# EAGLE design PWM Driver - Bridge Only (EAGLE 5.07)
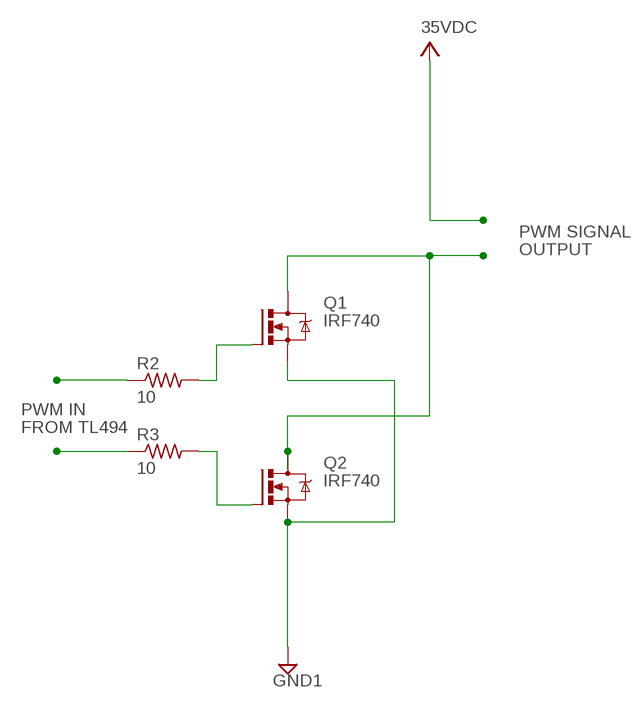
[diagram p0: schematic, sheet 1]

## Parts
Q1  IRF740  [TO220BV]
Q2  IRF740  [TO220BV]
R2  10  R-US_0207/10  [0207/10]
R3  10  R-US_0207/10  [0207/10]

## Nets
GND1: Q1.S Q2.S
N$1: R2.1
N$2: R3.1
N$3: Q1.D Q2.D
N$11: Q2.G R3.2
R2: Q1.G R2.2

## Notes on the sheet
- PWM SIGNAL
- OUTPUT
- PWM IN
- FROM TL494

## Library data of the parts
Q1 Q2 = transistor-power:IRF740: N-CHANNEL MOS FET
R2 R3 = resistor:R-US_: RESISTOR, American symbol

## Board
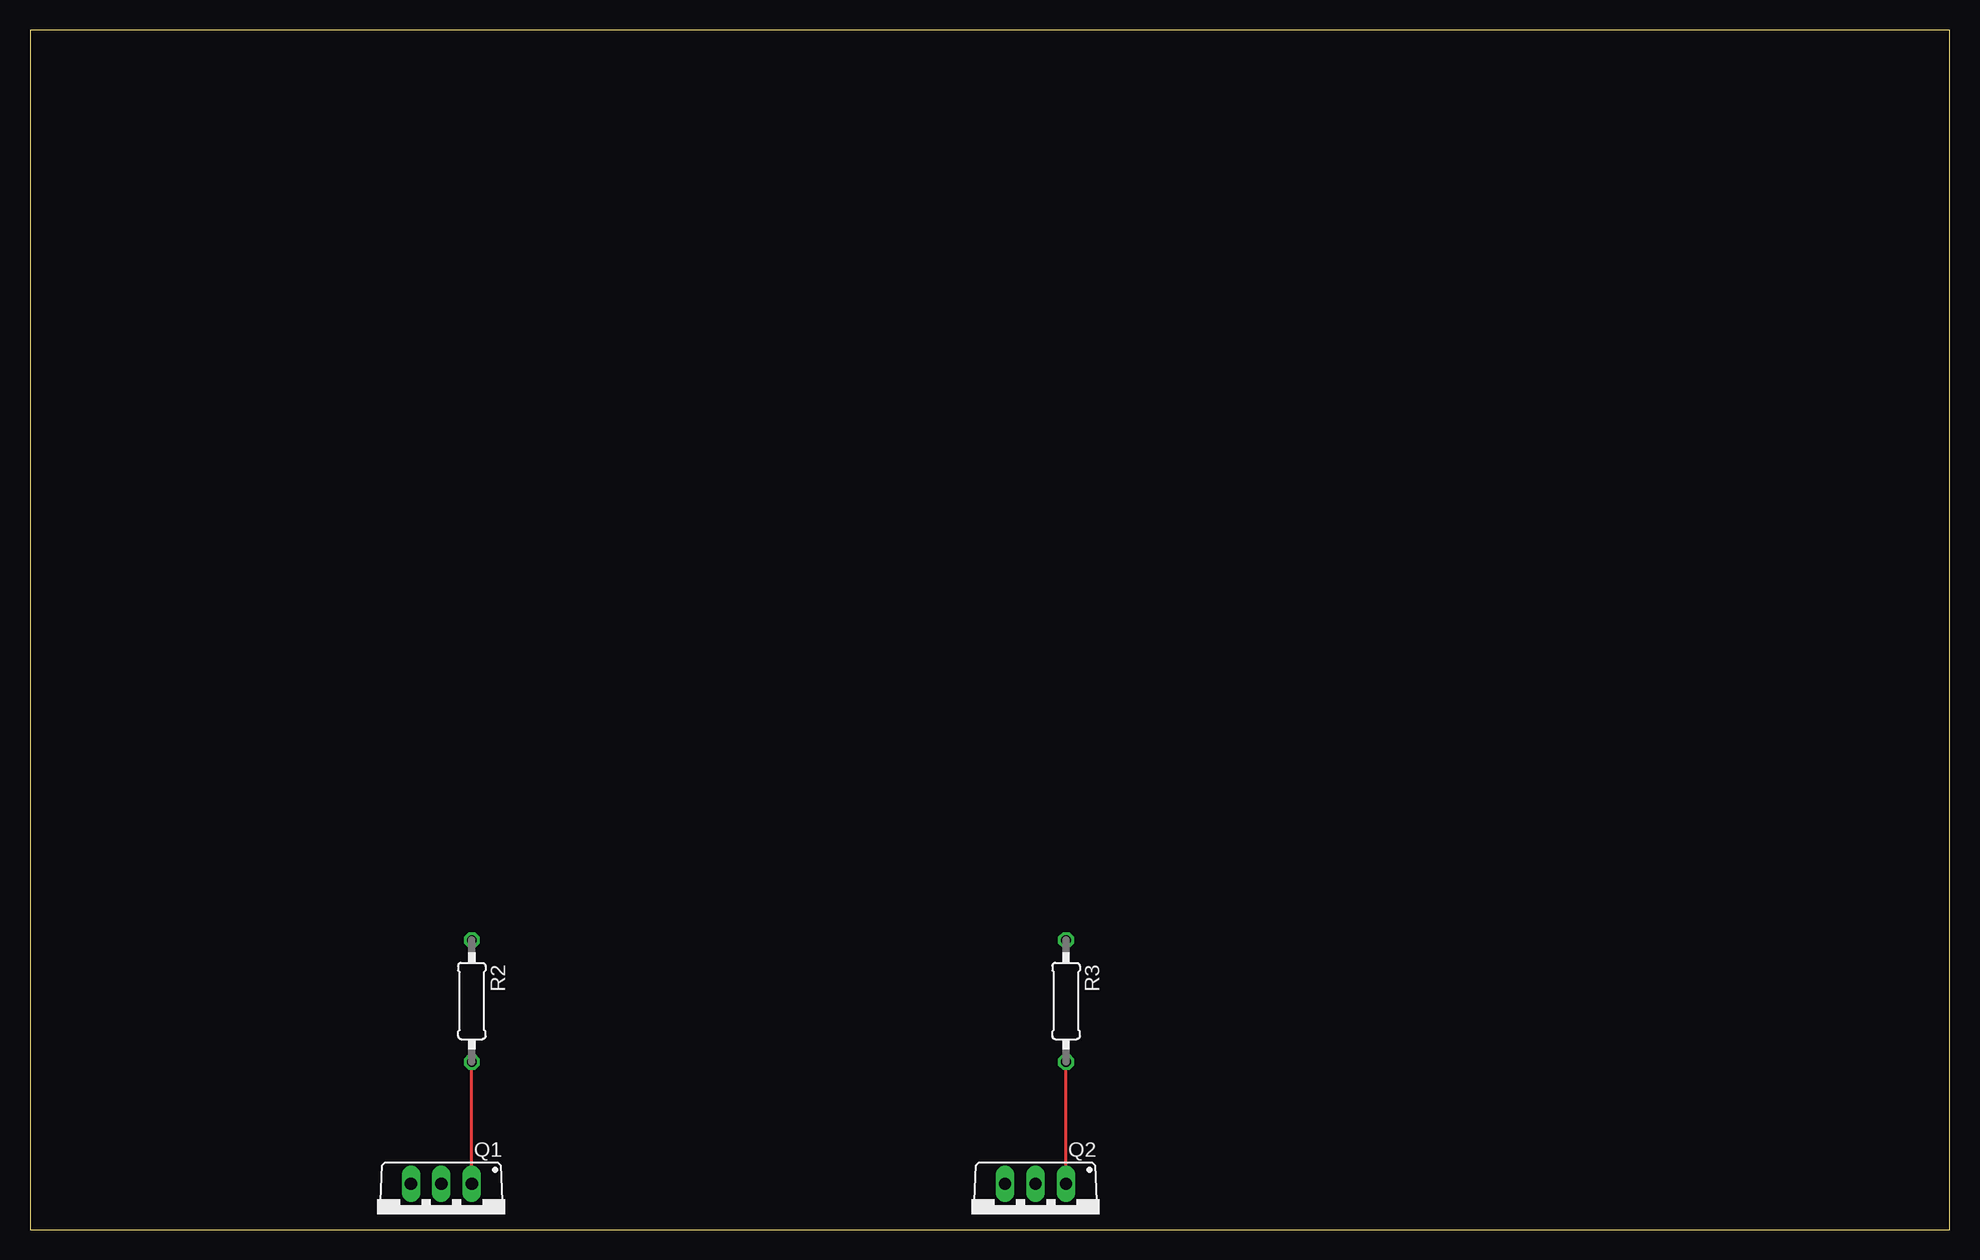
[diagram p1: board, top side]
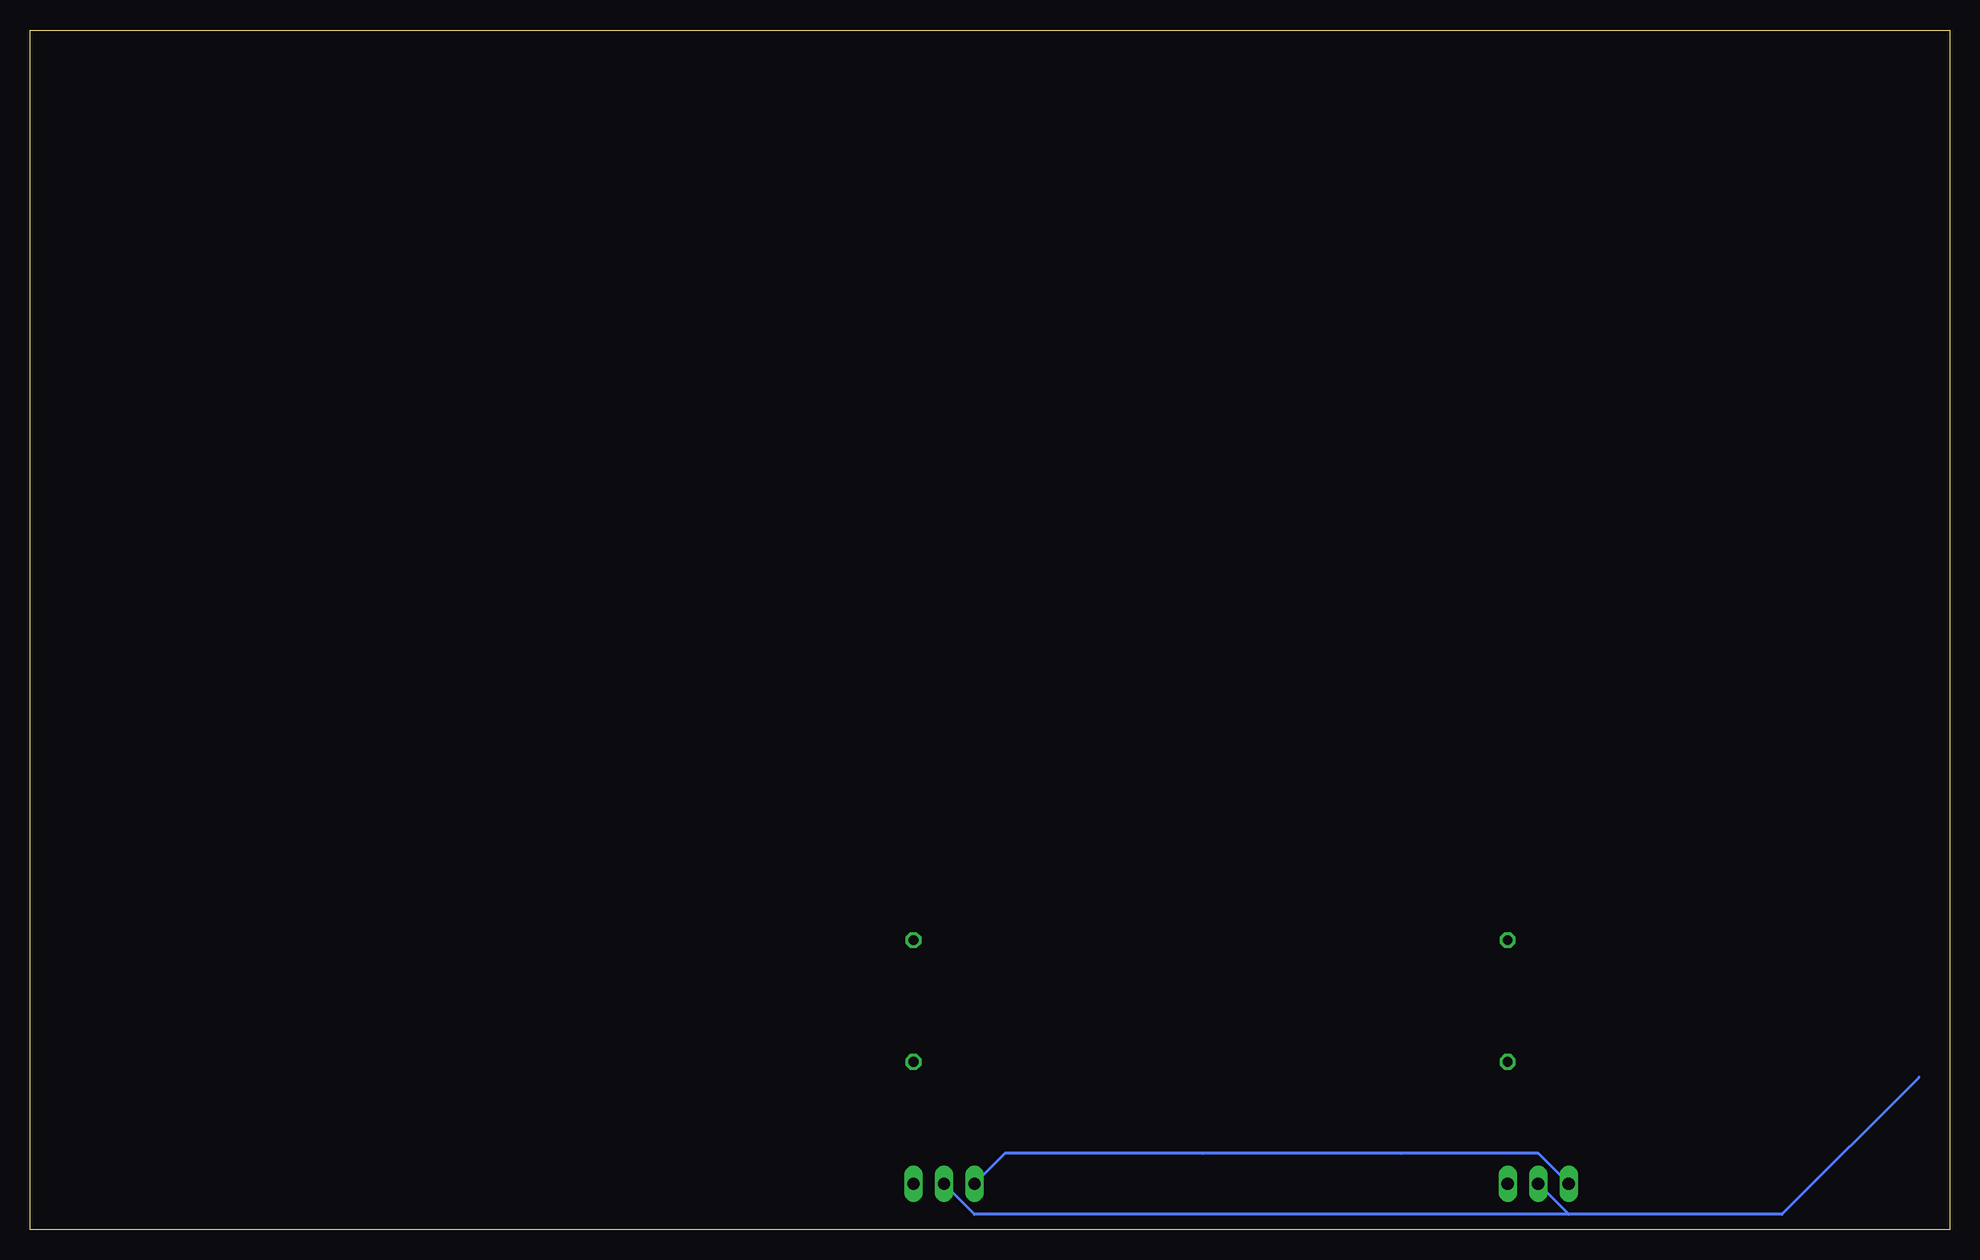
[diagram p2: board, bottom side, seen from below]

Size 160 x 100 mm. Coordinates in mm from the lower left corner, seen from the top.
Outline: 0,0 160,0 160,100 0,100 0,0
Copper layers (1*16): Top 0.035mm / dielectric 1.5mm / Bottom 0.035mm
Design rules "default": minimum track width 10mil, minimum drill 24mil, track to track 8mil, track to pad 8mil, pad to pad 8mil, via to via 8mil, smd to smd 8mil, copper to edge 40mil, drill to drill 8mil, minimum pad ring 10mil, minimum via ring 8mil, stop-mask expansion 4mil, vias tented up to drill 0mil, thermal gap 10mil

### Footprints (pad centres in the part's own frame; a part is rotated, then mirrored left to right if it is on the bottom)
TO220BV = drill 1.016 long: D 0,-2.54; G -2.54,-2.54; S 2.54,-2.54
0207/10 = drill 0.813 octagon: 1 -5.08,0; 2 5.08,0

### Placement (x,y rotation side)
Q1  34.29,1.27 180 top
Q2  83.82,1.27 180 top
R2  36.83,19.05 270 top
R3  86.36,19.05 270 top

### Tracks (layer width: path | path; a pad name or v marks a point on that pad's centre or on a via)
GND1
  Bottom 0.254: Q1.S 34.29,6.35 45.72,6.35 62.23,6.35 78.74,6.35 Q2.S
N$3
  Bottom 0.254: 31.75,1.27 Q1.D | 31.75,1.27 13.97,1.27 2.54,12.7 | Q2.D 81.28,1.27 31.75,1.27
N$11
  Top 0.254: Q2.G R3.2
R2
  Top 0.254: Q1.G R2.2